# Altium schematic sheet V2.SchDoc
size A4
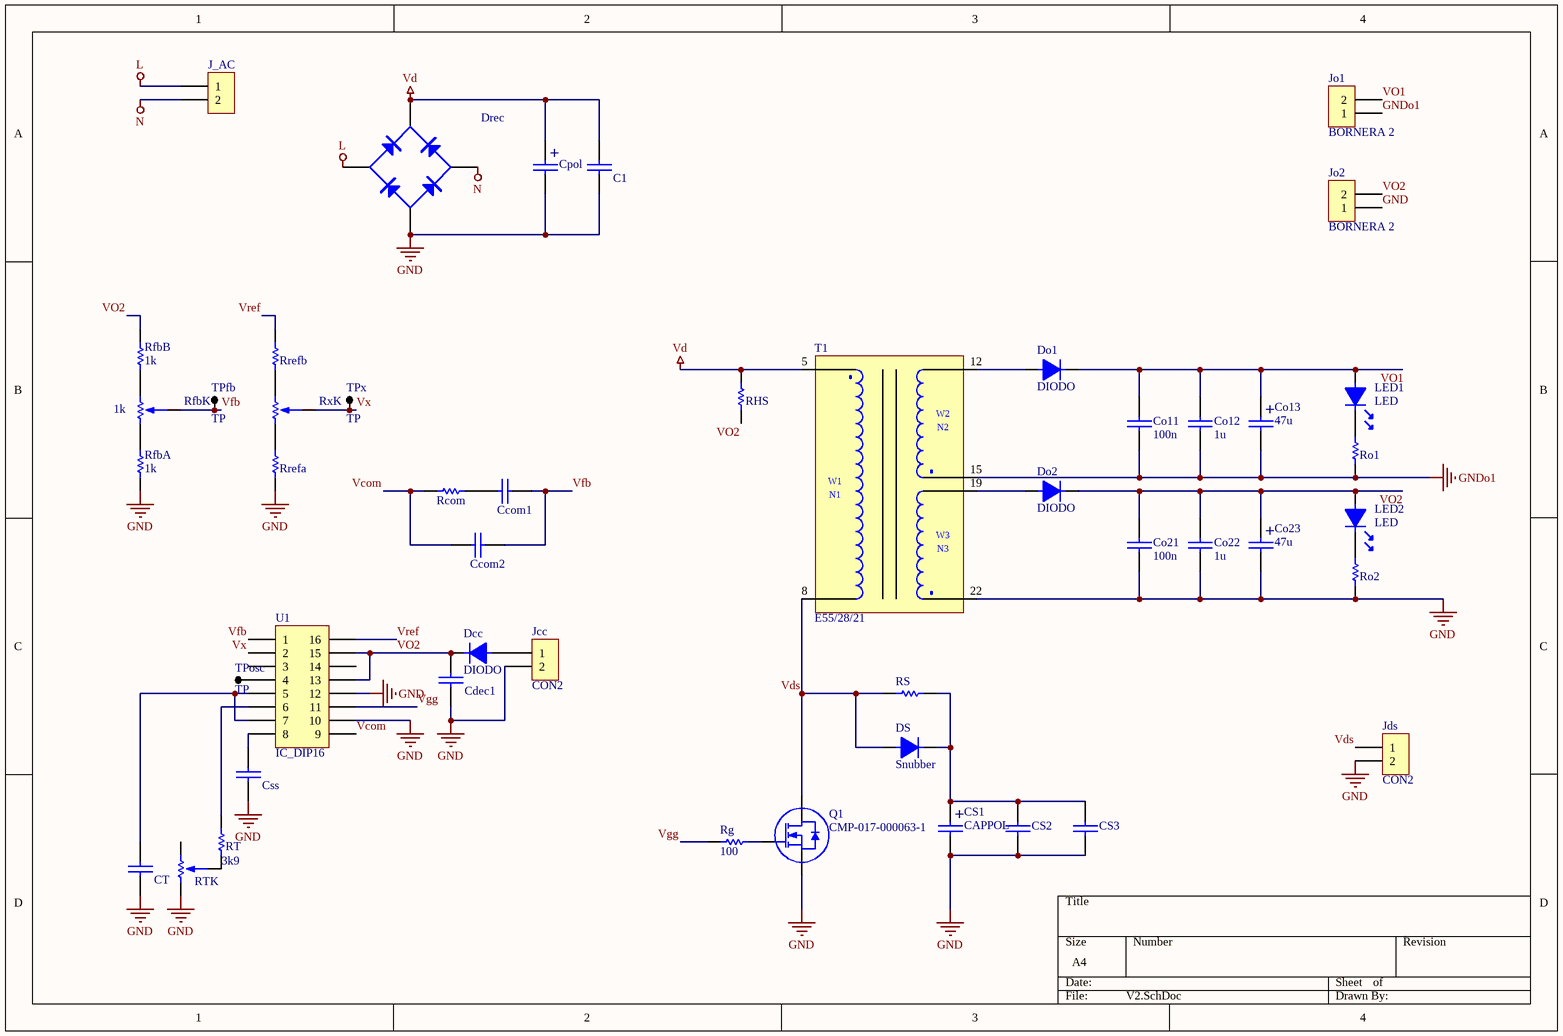
[diagram p0: V2.SchDoc]

## Parts
C1  CAP  [CAP200]  (value not drawn)
Ccom1  CAP  [CAP200]  (value not drawn)
Ccom2  CAP  [CAP200]  (value not drawn)
Cdec1  CAP  [CAP100]  (value not drawn)
Co11  100n  [CAP200]
Co12  1u  [CAP200]
Co13  47u  [CAP200RP]
Co21  100n  [CAP200]
Co22  1u  [CAP200]
Co23  47u  [CAP200RP]
Cpol  CAPPOL  [CAP200RP2]  (value not drawn)
CS1  CAPPOL  [CAP200RP]
CS2  (no value)  [CAP200]
CS3  (no value)  [CAP200]
Css  CAP  [CAP200]  (value not drawn)
CT  2n2  [CAP200]  (value not drawn)
Dcc  DIODO  [DO41]
Do1  DIODO  [DO41]
Do2  DIODO  [DO41]
Drec  (no value)  [PUENTE - W10M]
DS  Snubber  [DO41]
J_AC  (no value)  [BORNERA2]
Jcc  CON2  [SIP2]
Jds  CON2  [SIP2]
Jo1  BORNERA 2  [BORNERA2]
Jo2  BORNERA 2  [BORNERA2]
LED1  LED  [LED5]
LED2  LED  [LED5]
Q1  CMP-017-000063-1  [TO-220 V]
Rcom  RES  [RES400]  (value not drawn)
RfbA  1k  [RES400]
RfbB  1k  [RES400]
RfbK  1k  [PRESET V]
Rg  100  [RES400]
RHS  100k  [RES400]  (value not drawn)
Ro1  RES  [RES400]  (value not drawn)
Ro2  RES  [RES400]  (value not drawn)
Rrefa  RES  [RES400]  (value not drawn)
Rrefb  RES  [RES400]  (value not drawn)
RS  (no value)  [RES400]
RT  3k9  [RES400]
RTK  1k  [PRESET V]  (value not drawn)
RxK  PRESET  [PRESET V]  (value not drawn)
T1  E55/28/21  [E55/28/21]
TPfb  TP  [TPTH]
TPosc  TP  [TPTH]
TPx  TP  [TPTH]
U1  IC_DIP16  [DIP16]

## Nets
GND: C1.2 Cdec1.2 Co21.2 Co22.2 Co23.2 Cpol.2 CS1.2 CS2.1 CS3.1 Css.2 CT.2 Drec.3(V-) Jcc.2 Jds.2 Jo2.1 Q1.3(S) RfbA.1 Ro2.2 Rrefa.2 RTK.3 T1.22 U1.10 U1.12
GNDo1: Co11.2 Co12.2 Co13.2 Jo1.1 Ro1.1 T1.15
L: Drec.2(AC) J_AC.1
N: Drec.4(AC) J_AC.2
Vd: C1.1 Cpol.1 Drec.1(V+) RHS.2 T1.5
Vcom: Ccom2.1 Rcom.1 U1.9
Vds: DS.1 Jds.1 Q1.2(D) RS.1 T1.8
Vfb: Ccom1.2 Ccom2.2 RfbK.2 TPfb.1 U1.1
Vgg: Rg.1 U1.11
VO1: Co11.1 Co12.1 Co13.1 Do1.2 Jo1.2 LED1.1
VO2: Cdec1.1 Co21.1 Co22.1 Co23.1 Dcc.2 Do2.2 Jo2.2 LED2.1 RfbB.2 RHS.1 U1.13 U1.15
Vref: Rrefb.1 U1.16
Vx: RxK.2 TPx.1 U1.2
NetCcom1_1: Ccom1.1 Rcom.2
NetCS1_1: CS1.1 CS2.2 CS3.2 DS.2 RS.2
NetCss_1: Css.1 U1.8
NetCT_1: CT.1 U1.5 U1.7
NetDcc_1: Dcc.1 Jcc.1
NetDo1_1: Do1.1 T1.12
NetDo2_1: Do2.1 T1.19
NetLED1_2: LED1.2 Ro1.2
NetLED2_2: LED2.2 Ro2.1
NetQ1_1: Q1.1(G) Rg.2
NetRfbA_2: RfbA.2 RfbK.3
NetRfbB_1: RfbB.1 RfbK.1
NetRrefa_1: Rrefa.1 RxK.3
NetRrefb_2: Rrefb.2 RxK.1
NetRT_1: RT.1 U1.6
NetRT_2: RT.2 RTK.2
NetTPosc_1: TPosc.1 U1.4

Not connected (* = marked no-connect by the designer): RTK 1; U1 3 14

## Notes on the sheet
- (in symbol CMP-006-000001-1) +
- (in symbol E55/28/21) W2; N2; W1; N1; W3; N3

## Library data of the parts
C1 Co11 Co21 Co22 CS2 CS3 Css = CMP-006-000000-1: Design Item ID: CAP; Source: Schematics.SchLib
Ccom1 Ccom2 Cdec1 CT = CMP-024-000000-1: Pin Count: 2; Component Type: Standard; Source: Schematics.SchLib; Design Item ID: CAP
Co12 = CMP-024-000002-1: Design Item ID: CAP; Pin Count: 2; Source: Schematics.SchLib; Component Type: Standard
Co13 Co23 Cpol CS1 = CMP-006-000001-1: Design Item ID: CAPPOL; Source: Schematics.SchLib
Dcc Do1 Do2 DS = CMP-008-000001-1: Design Item ID: DIODO; Source: Schematics.SchLib
Drec = CMP-008-000003-1: Source: Schematics.SchLib; Design Item ID: PUENTE
J_AC Jo1 Jo2 = CMP-017-000066-1: Source: Schematics.SchLib; Design Item ID: BORNERA 2
Jcc Jds = CMP-017-000004-1: Design Item ID: CON2; Source: Schematics.SchLib
LED1 LED2 = CMP-026-000002-1: Component Type: Standard; Design Item ID: LED; Source: Schematics.SchLib; Pin Count: 2
Rcom RfbA RfbB Rg RHS Ro1 Ro2 RS = CMP-013-000000-1: Source: Schematics.SchLib; Design Item ID: RES
RfbK RTK RxK = CMP-031-000001-1: Design Item ID: PRESET; Pin Count: 3; Source: Schematics.SchLib; Component Type: Standard
Rrefa Rrefb RT = CMP-031-000002-1: Component Type: Standard; Source: Schematics.SchLib; Pin Count: 2; Design Item ID: RES
T1 = E55/28/21: Transistor E55/28/21
TPfb TPosc TPx = CMP-015-000000-1: Source: Schematics.SchLib; Design Item ID: TP
U1 = CMP-017-000059-1: Source: Schematics.SchLib; Design Item ID: IC_DIP16
Q1 = CMP-017-000063-1: Design Item ID: MOSFET N; Source: Schematics.SchLib